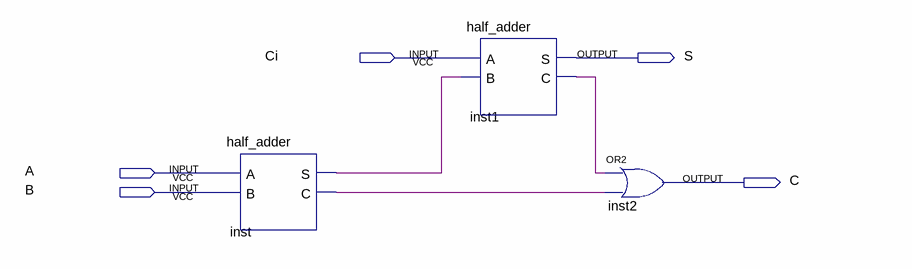
[diagram p0: schematic sheet]
// Quartus schematic HALF_ADDER(2).bdf as structural Verilog: 3 symbols, 5 pins
module \HALF_ADDER(2)  (
  input  Ci,
  input  A,
  input  B,
  output S,
  output C
);

  wire inst1_c, inst_c, inst_s;

  half_adder inst (.A(A), .B(B), .S(inst_s), .C(inst_c));
  half_adder inst1 (.A(Ci), .B(inst_s), .S(S), .C(inst1_c));
  or inst2 (C, inst1_c, inst_c);
endmodule
